# Altium schematic sheet 015_SoC USB & USB_A & USB_C.SchDoc
size 420 x 297 mm; Page Create Date: May 29, 2006; WebSite: https://www.seeedstudio.com; Variant Name: <Core Design>; Page Number: 15; Drawing: qxn; Schematic Name: BeaglePlay; Page Size: A3; Comment: Seeed Title; Page Count: 22; Page Name: 015_SoC USB & USB_A & USB_C; Company: Seeed Studio; RevCode: v0.2; DsnPath: C:\Users\a0488739\Documents\GitHub\beagleplay\allegro\DVT\BEAGLEPLAYV020_220915.DSN; SchematicName: BeaglePlay; PageName: 015_SoC USB & USB_A & USB_C; PageSize: A3; TopSchematic: True
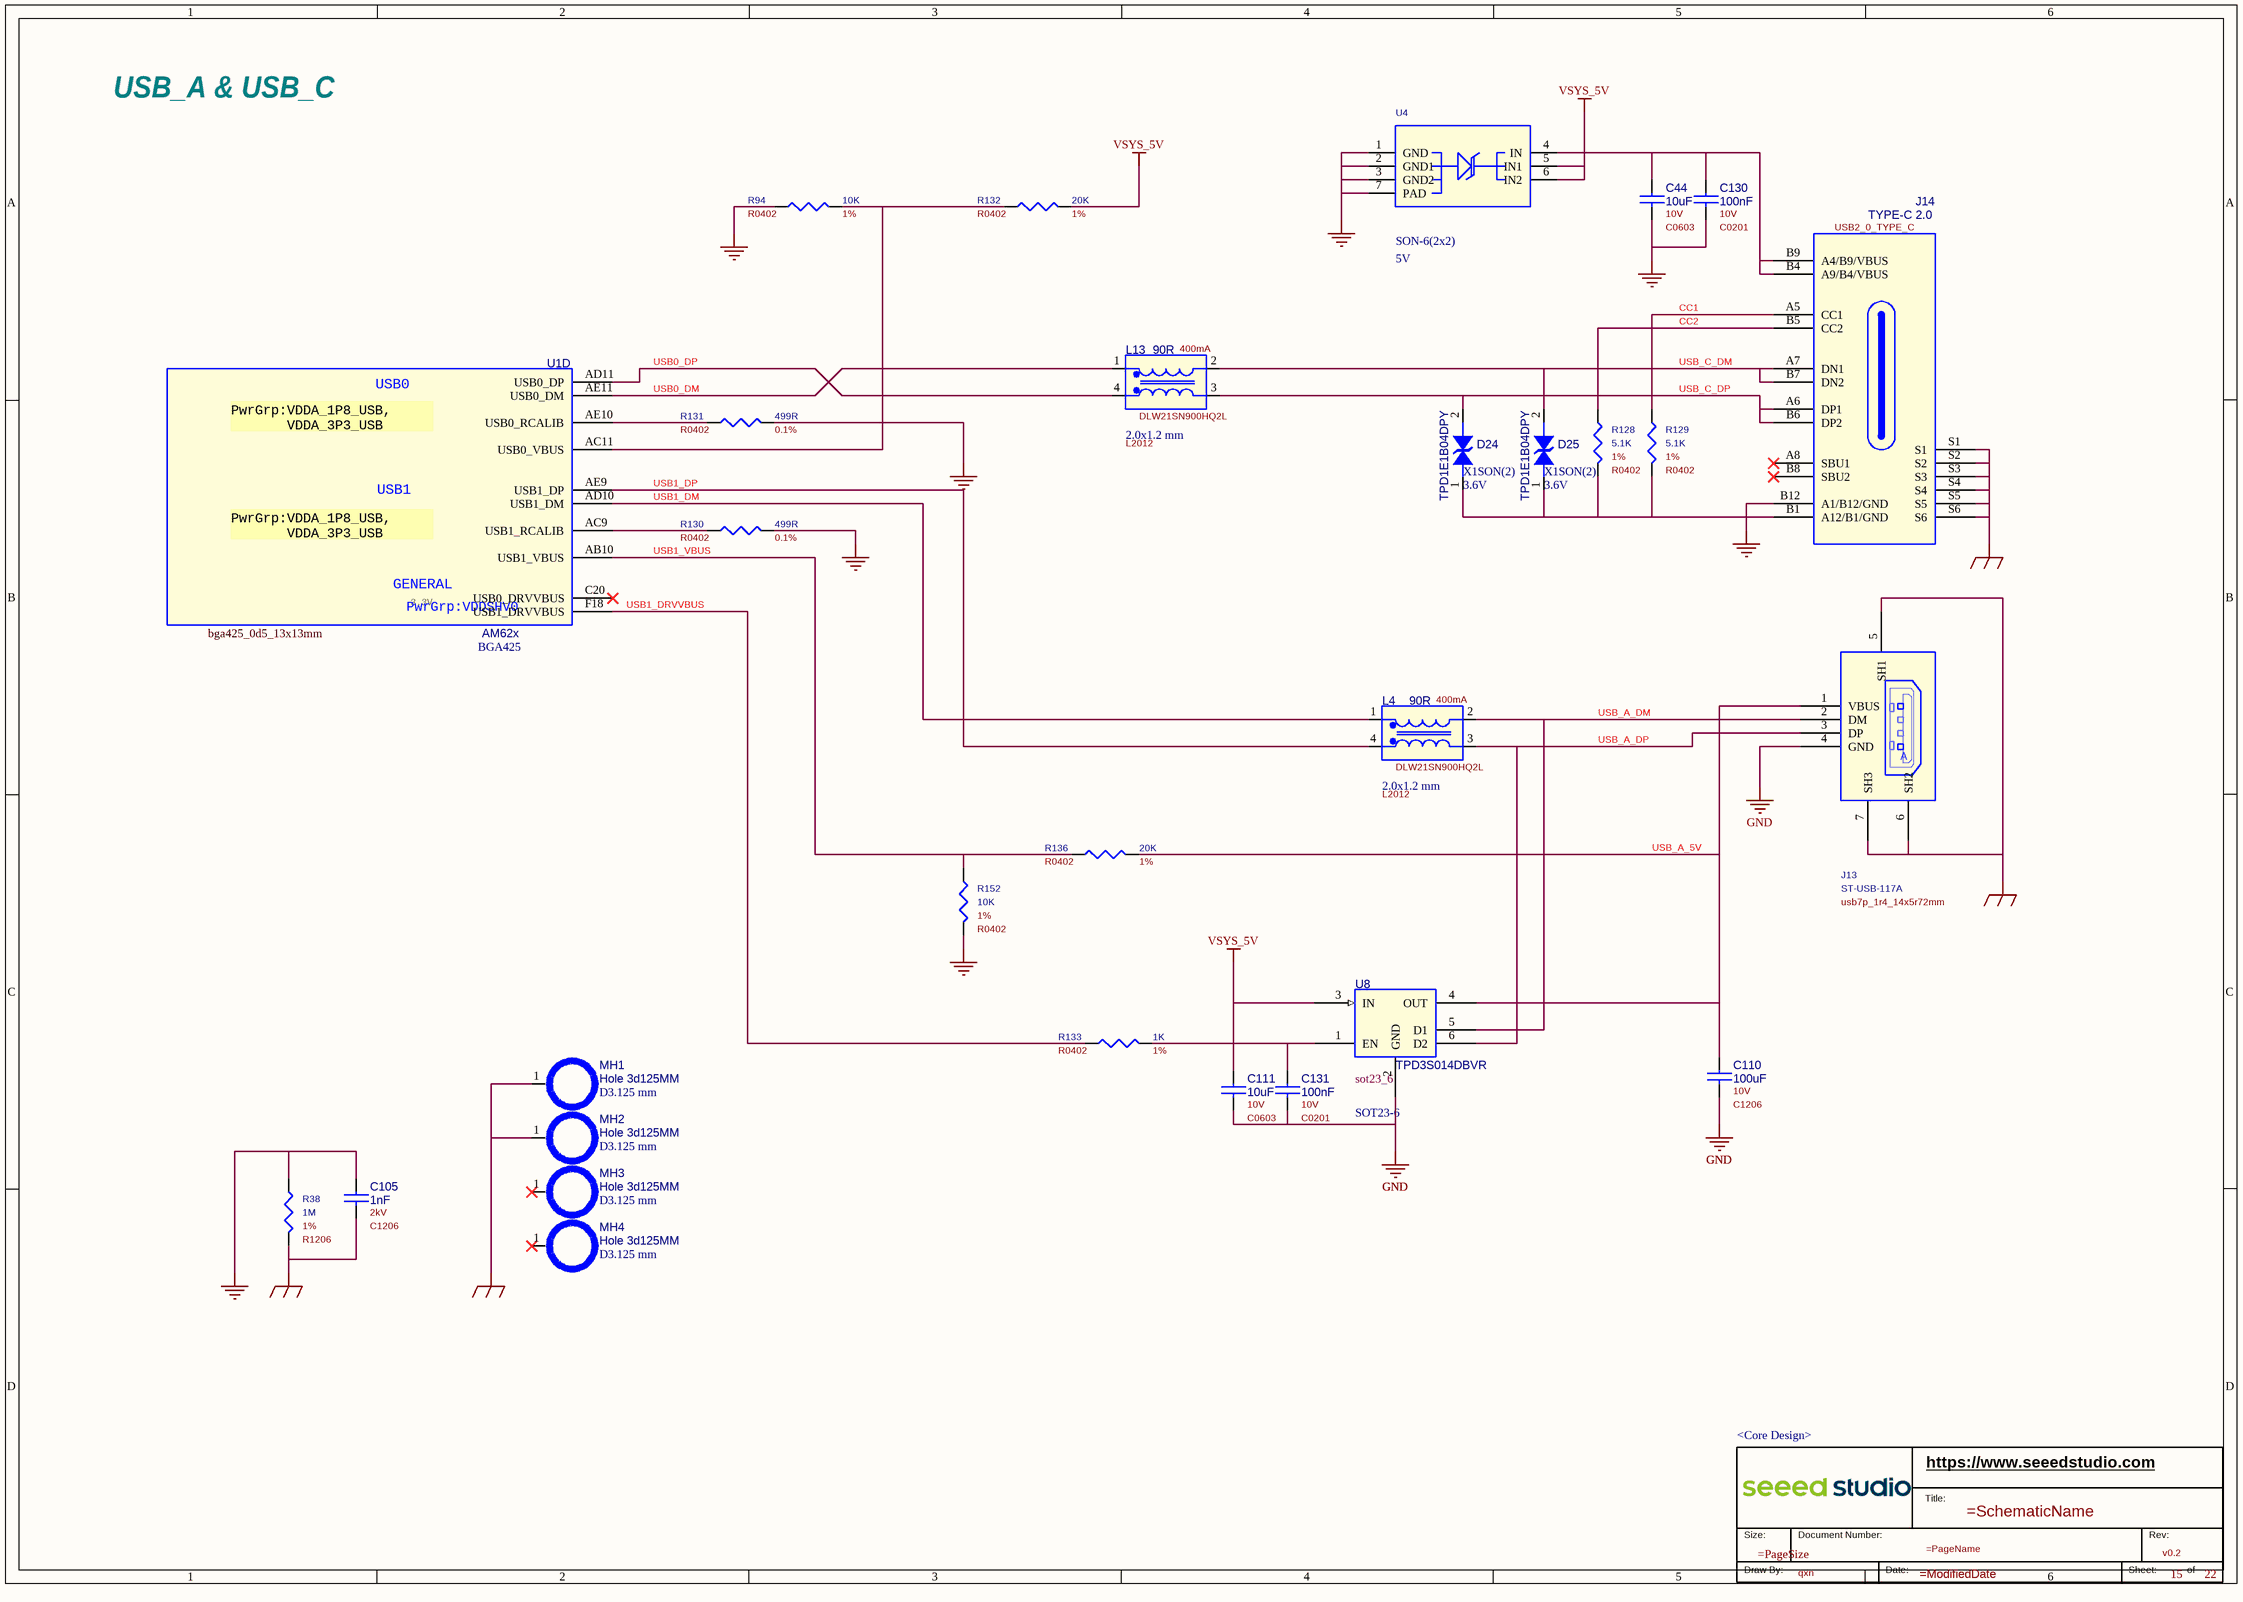
[diagram p0: 015_SoC USB & USB_A & USB_C.SchDoc]

## Parts
*  RevCode: v0.2  Page Number: 15  Page Count: 22  Drawing: qxn  Variant Name: <Core Design>  (hidden comment: Seeed Title)  (graphical)
C44  value 10uF  Rating: 10V  [C0603]  (hidden comment: CC)
C105  value 1nF  Rating: 2kV  [C1206]  (hidden comment: CC)
C110  value 100uF  Rating: 10V  [C1206]  (hidden comment: CC)
C111  value 10uF  Rating: 10V  [C0603]  (hidden comment: CC)
C130  value 100nF  Rating: 10V  [C0201]  (hidden comment: CC)
C131  value 100nF  Rating: 10V  [C0201]  (hidden comment: CC)
D24  value TPD1E1B04DPY  Package Size: X1SON(2)  Rated Voltage: 3.6V  [D0402]  (hidden comment: DIODE TVS BI-DIR)
D25  value TPD1E1B04DPY  Package Size: X1SON(2)  Rated Voltage: 3.6V  [D0402]  (hidden comment: DIODE TVS BI-DIR)
J13  value ST-USB-117A  PCB Footprint: usb7p_1r4_14x5r72mm  [CON_USBDUAL72309]  (hidden comment: Single USB A_180D)
J14  value TYPE-C 2.0  [USB2_0_TYPE_C]  (hidden comment: USB2.0_Type C_16+6P#1)
L4  value 90R  Manufacturer Part Number: DLW21SN900HQ2L  Rating: 400mA  Package Size: 2.0x1.2 mm  [L2012]  (hidden comment: CL)
L13  value 90R  Manufacturer Part Number: DLW21SN900HQ2L  Rating: 400mA  Package Size: 2.0x1.2 mm  [L2012]  (hidden comment: CL)
MH1  value Hole 3d125MM  Package Size: D3.125 mm  [PTH_3_125mm_5]  (hidden comment: MHole)
MH2  value Hole 3d125MM  Package Size: D3.125 mm  [PTH_3_125mm_5]  (hidden comment: MHole)
MH3  value Hole 3d125MM  Package Size: D3.125 mm  [PTH_3_125mm_5]  (hidden comment: MHole)
MH4  value Hole 3d125MM  Package Size: D3.125 mm  [PTH_3_125mm_5]  (hidden comment: MHole)
R38  value 1M  Rating: 1%  [R1206]  (hidden comment: R)
R94  value 10K  Rating: 1%  [R0402]  (hidden comment: R)
R128  value 5.1K  Rating: 1%  [R0402]  (hidden comment: R)
R129  value 5.1K  Rating: 1%  [R0402]  (hidden comment: R)
R130  value 499R  Rating: 0.1%  [R0402]  (hidden comment: R)
R131  value 499R  Rating: 0.1%  [R0402]  (hidden comment: R)
R132  value 20K  Rating: 1%  [R0402]  (hidden comment: R)
R133  value 1K  Rating: 1%  [R0402]  (hidden comment: R)
R136  value 20K  Rating: 1%  [R0402]  (hidden comment: R)
R152  value 10K  Rating: 1%  [R0402]  (hidden comment: R)
U1  value AM62x  Package Size: BGA425  [bga425_0d5_13x13mm]  (hidden comment: AM62x_BGA425)  (part D of 19)
U4  Package Size: SON-6(2x2)  Rated Voltage: 5V  [WSON6_0d65_2x2x0_8mm]  (hidden comment: TVS0500DRVR)
U8  value TPD3S014DBVR  Package Size: SOT23-6  [sot23_6]  (hidden comment: TPD3S014D_SOT23-6)

## Nets
GND: C44.2 C105.1 C110.2 C111.2 C130.2 C131.2 D24.1 D25.1 J13.4(GND) J14.B1(A12/B1/GND) J14.B12(A1/B12/GND) R38.1 R94.1 R128.2 R129.2 R130.2 R131.2 R152.2 U4.1(GND) U4.2(GND1) U4.3(GND2) U4.7(PAD) U8.2(GND)
GND_EARTH: C105.2 J13.5(SH1) J13.6(SH2) J13.7(SH3) J14.S1 J14.S2 J14.S3 J14.S4 J14.S5 J14.S6 MH1.1(NC) MH2.1(NC) R38.2
VSYS_5V: C44.1 C111.1 C130.1 J14.B4(A9/B4/VBUS) J14.B9(A4/B9/VBUS) R132.2 U4.4(IN) U4.5(IN1) U4.6(IN2) U8.3(IN)
CC1: J14.A5(CC1) R129.1
CC2: J14.B5(CC2) R128.1
USB0_DM: L13.1 U1.AE11(USB0_DM)
USB0_DP: L13.4 U1.AD11(USB0_DP)
USB1_DM: L4.1 U1.AD10(USB1_DM)
USB1_DP: L4.4 U1.AE9(USB1_DP)
USB1_DRVVBUS: R133.1 U1.F18(USB1_DRVVBUS)
USB1_VBUS: R136.1 R152.1 U1.AB10(USB1_VBUS)
USB_A_5V: C110.1 J13.1(VBUS) R136.2 U8.4(OUT)
USB_A_DM: J13.2(DM) L4.2 U8.5(D1)
USB_A_DP: J13.3(DP) L4.3 U8.6(D2)
USB_C_DM: D25.2 J14.A7(DN1) J14.B7(DN2) L13.2
USB_C_DP: D24.2 J14.A6(DP1) J14.B6(DP2) L13.3
NetC131_1: C131.1 R133.2 U8.1(EN)
NetR94_2: R94.2 R132.1 U1.AC11(USB0_VBUS)
NetR130_1: R130.1 U1.AC9(USB1_RCALIB)
NetR131_1: R131.1 U1.AE10(USB0_RCALIB)

Not connected (* = marked no-connect by the designer): J14 A8(SBU1)* B8(SBU2)*; MH3 1(NC)*; MH4 1(NC)*; U1 C20(USB0_DRVVBUS)*

## Notes on the sheet
- USB_A & USB_C
- 3.3V
- (in symbol AM62x_BGA425, part D) USB0; PwrGrp:VDDA_1P8_USB, / VDDA_3P3_USB; USB1; GENERAL; PwrGrp:VDDSHV0
- (in symbol Seeed Title) https://www.seeedstudio.com; Title:; Size:; Document Number:; Rev:; Draw By:; Date:; Sheet:; of
- (in symbol Single USB A_180D) A

## Library data of the parts
* = Seeed Title: Company: Seeed Studio; WebSite: https://www.seeedstudio.com; Schematic Name: =SchematicName; Page Size: =PageSize; Page Name: =PageName; Page Create Date: May 29, 2006; Page Modify Date: =ModifiedDate
C44 = CC: CAP, Ceramic, SMD, 10uF, 10%, 10V, 0603; Part Reference: C44; Manufacturer PN: CC0603KRX5R6BB106; Manufacturer: YAGEO; Company Part Status: BeagleBone Carrier Board; CLASS: DISCRETE; Temperature Coefficient: X5R; PN: 302010103; PCB Footprint: C0603; Tolerance: 10%; Dielectric Type: Ceramic; Package Size: 0603
C105 = CC: CAP, Ceramic, SMD, 1nF, 10%, 2kV, 1206; Part Reference: C105; Company Part Status: BeagleBone Carrier Board; Manufacturer: YAGEO; Manufacturer PN: CC1206KKX7RDBB102; PN: 302011962; Temperature Coefficient: X7R; CLASS: DISCRETE; SIGNAL_MODEL: DEFAULT_CAPACITOR_1000pF_1_2; PCB Footprint: C1206; Package Size: 1206; Dielectric Type: Ceramic; Tolerance: 10%
C110 = CC: CAP, Ceramic, SMD, 100uF, 20%, 10V, 1206; Part Reference: C110; Manufacturer PN: C3216X5R1A107M160AC; Manufacturer: TDK; Company Part Status: BeagleBone Carrier Board; CLASS: DISCRETE; Temperature Coefficient: X5R; PN: 302010747; PCB Footprint: C1206; Tolerance: 20%; Dielectric Type: Ceramic; Package Size: 1206
C111 = CC: CAP, Ceramic, SMD, 10uF, 10%, 10V, 0603; Part Reference: C111; Company Part Status: BeagleBone Carrier Board; Manufacturer: YAGEO; Manufacturer PN: CC0603KRX5R6BB106; PN: 302010103; Temperature Coefficient: X5R; CLASS: DISCRETE; PCB Footprint: C0603; Package Size: 0603; Dielectric Type: Ceramic; Tolerance: 10%
C130 = CC: CAP, Ceramic, SMD, 100nF, 10%, 10V, 0201; Part Reference: C130; Company Part Status: ODYSSEY-i.MX8M; Manufacturer: YAGEO; Manufacturer PN: CC0201KRX5R6BB104; PN: 302010271; Temperature Coefficient: X5R; CLASS: DISCRETE; PCB Footprint: C0201; Package Size: 0201; Dielectric Type: Ceramic; Tolerance: 10%
C131 = CC: CAP, Ceramic, SMD, 100nF, 10%, 10V, 0201; Part Reference: C131; Manufacturer PN: CC0201KRX5R6BB104; Manufacturer: YAGEO; Company Part Status: ODYSSEY-i.MX8M; CLASS: DISCRETE; Temperature Coefficient: X5R; PN: 302010271; PCB Footprint: C0201; Tolerance: 10%; Dielectric Type: Ceramic; Package Size: 0201
D24 = DIODE TVS BI-DIR: DIO, ESD, TPD1E1B04DPY, --, 3.6V, --, X1SON(2); Part Reference: D24; Manufacturer: TI; Manufacturer Part Number: TPD1E1B04DPYR/T; Company Part Status: Grove Base Cape for PocketBeagle; Manufacturer PN: TPD1E1B04DPYR; PN: 304050798; CLASS: DISCRETE; PCB Footprint: D0402; Part Type: ESD; Status: Grove Base Cape for PocketBeagle; Temperature: -40¡ãC to 125¡ãC
D25 = DIODE TVS BI-DIR: DIO, ESD, TPD1E1B04DPY, --, 3.6V, --, X1SON(2); Part Reference: D25; Manufacturer: TI; Manufacturer Part Number: TPD1E1B04DPYR/T; Company Part Status: Grove Base Cape for PocketBeagle; Manufacturer PN: TPD1E1B04DPYR; PN: 304050798; CLASS: DISCRETE; PCB Footprint: D0402; Part Type: ESD; Status: Grove Base Cape for PocketBeagle; Temperature: -40¡ãC to 125¡ãC
J13 = Single USB A_180D: CONN, USB, 4P, DIP; Part Reference: J13; Company Part Status: SCG Vehicle Device; Manufacturer: SUNGTECH; PN: 320010495; CLASS: IO; Package Size: 4P-2.0-Side; Manufacturer PN: ST-USB-117A
J14 = USB2.0_Type C_16+6P#1: CONN, USB, TYPE-C 2.0, 16+6, SMD; Part Reference: J14; Manufacturer: MTCONN; Manufacturer PN: UBF31-0171; PN: 320010943; Contact Voltage: 30 V; CLASS: IO; PCB Footprint: USB2_0_TYPE_C; Package Size: 8.94 x 7.55 mm
L4 = CL: Common Mode Filter, 90R, , 400mA, 2.0x1.2 mm; Part Reference: L4; Manufacturer PN: SRF2012-900YA; Company Part Status: BeagleBone Carrier Board; Manufacturer: Bourns; CLASS: DISCRETE; PN: 303050063; Priority: A; PCB Footprint: L2012; Part Type: Common Mode Filter; Status: BeagleBone AI TDA4VM; Temperature: -40¡ãC to 85¡ãC
L13 = CL: Common Mode Filter, 90R, , 400mA, 2.0x1.2 mm; Part Reference: L13; Manufacturer: Bourns; Company Part Status: BeagleBone Carrier Board; Manufacturer PN: SRF2012-900YA; Priority: A; PN: 303050063; CLASS: DISCRETE; PCB Footprint: L2012; Temperature: -40¡ãC to 85¡ãC; Status: BeagleBone AI TDA4VM; Part Type: Common Mode Filter
MH1 = MHole: MISC, Mhole, Hole 3d125MM, DIP, 4D5MM; Part Reference: MH1; Company Part Status: MS; CLASS: DISCRETE; PN: Mhole001; PCB Footprint: PTH_3_125mm_5
MH2 = MHole: MISC, Mhole, Hole 3d125MM, DIP, 4D5MM; Part Reference: MH2; Company Part Status: MS; CLASS: DISCRETE; PN: Mhole001; PCB Footprint: PTH_3_125mm_5
MH3 = MHole: MISC, Mhole, Hole 3d125MM, DIP, 4D5MM; Part Reference: MH3; Company Part Status: MS; PN: Mhole001; CLASS: DISCRETE; PCB Footprint: PTH_3_125mm_5
MH4 = MHole: MISC, Mhole, Hole 3d125MM, DIP, 4D5MM; Part Reference: MH4; Company Part Status: MS; PN: Mhole001; CLASS: DISCRETE; PCB Footprint: PTH_3_125mm_5
R38 = R: RES, Thick Film, 1M, 1%, 1/4W, SMD, 1206; Part Reference: R38; Company Part Status: Sensecap Gateway V1; Manufacturer: YAGEO; Manufacturer PN: RC1206FR-071ML; PN: 301010410; CLASS: DISCRETE; SIGNAL_MODEL: DEFAULT_RESISTOR_0.001OHM_1_2; PCB Footprint: R1206; Package Size: 1206; Rated Power: 1/4W
R94 = R: RES, Thick Film, 10K, 1%, 1/16W, SMD, 0402; Part Reference: R94; Company Part Status: BeagleBone Carrier Board; Manufacturer: YAGEO; Manufacturer PN: RC0402FR-0710KL; PN: 301010047; CLASS: DISCRETE; PCB Footprint: R0402; Package Size: 0402; Rated Power: 1/16W
R128 = R: RES, Thick Film, 5.1K, 1%, 1/16W, SMD, 0402; Part Reference: R128; Company Part Status: Geni; Manufacturer: YAGEO; Manufacturer PN: RC0402FR-075K1L; PN: 301010495; CLASS: DISCRETE; PCB Footprint: R0402; Package Size: 0402; Rated Power: 1/16W
R129 = R: RES, Thick Film, 5.1K, 1%, 1/16W, SMD, 0402; Part Reference: R129; Company Part Status: Geni; Manufacturer: YAGEO; Manufacturer PN: RC0402FR-075K1L; PN: 301010495; CLASS: DISCRETE; PCB Footprint: R0402; Package Size: 0402; Rated Power: 1/16W
R130 = R: RES, Thick Film, 499R, 0.1%, 1/16W, SMD, 0402; Part Reference: R130; Manufacturer PN: RT0402BRE07499RL; Manufacturer: YAGEO; Company Part Status: Beaglebone LoRa Gateway; CLASS: DISCRETE; PN: 301010848; PCB Footprint: R0402; Rated Power: 1/16W; Package Size: 0402
R131 = R: RES, Thick Film, 499R, 0.1%, 1/16W, SMD, 0402; Part Reference: R131; Manufacturer PN: RT0402BRE07499RL; Manufacturer: YAGEO; Company Part Status: Beaglebone LoRa Gateway; CLASS: DISCRETE; PN: 301010848; PCB Footprint: R0402; Rated Power: 1/16W; Package Size: 0402
R132 = R: RES, Thick Film, 20K, 1%, 1/16W, SMD, 0402; Part Reference: R132; Company Part Status: Grove Base Cape for PocketBeagle; Manufacturer: YAGEO; Manufacturer PN: RC0402FR-0720KL; PN: 301010072; CLASS: DISCRETE; PCB Footprint: R0402; Package Size: 0402; Rated Power: 1/16W
R133 = R: RES, Thick Film, 1K, 1%, 1/16W, SMD, 0402; Part Reference: R133; Manufacturer PN: RC0402FR-071KL; Manufacturer: YAGEO; Company Part Status: Combox Pro; CLASS: DISCRETE; PN: 301010044; PCB Footprint: R0402; Rated Power: 1/16W; Package Size: 0402
R136 = R: RES, Thick Film, 20K, 1%, 1/16W, SMD, 0402; Part Reference: R136; Company Part Status: Grove Base Cape for PocketBeagle; Manufacturer: YAGEO; Manufacturer PN: RC0402FR-0720KL; PN: 301010072; CLASS: DISCRETE; PCB Footprint: R0402; Package Size: 0402; Rated Power: 1/16W
R152 = R: RES, Thick Film, 10K, 1%, 1/16W, SMD, 0402; Part Reference: R152; Company Part Status: BeagleBone Carrier Board; Manufacturer: YAGEO; Manufacturer PN: RC0402FR-0710KL; PN: 301010047; CLASS: DISCRETE; PCB Footprint: R0402; Package Size: 0402; Rated Power: 1/16W
U1 = AM62x_BGA425: IC, Controller, MPU, AM62x, BGA425; Part Reference: U1; Manufacturer PN: AM6254ATCGGHALWR; Manufacturer: TI; Company Part Status: BeaglePlay; PN: 310011537; PCB Footprint: bga425_0d5_13x13mm; CLASS: IC
U4 = TVS0500DRVR: DIO, TVS, TVS0500DRVR, --, 5V, --, SON-6(2x2); Part Reference: U4; Company Part Status: BeaglePlay; Manufacturer: TI; PN: 304051039; CLASS: DISCRETE; PCB Footprint: WSON6_0d65_2x2x0_8mm; Manufacturer PN: TVS0500DRVR
U8 = TPD3S014D_SOT23-6: IC, PMIC, Power Switch, TPD3S014DBVR, SOT23-6; Part Reference: U8; Manufacturer: TI; Company Part Status: BeaglePlay; PN: 310032515; PCB Footprint: sot23_6; Manufacturer PN: TPD3S014DBVR; CLASS: IC